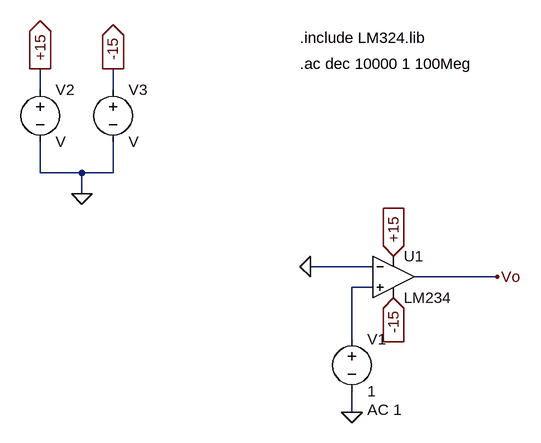
[diagram p0: schematic borrador1.asc]
borrador1.asc, the LTspice schematic file:
Version 4.1
SHEET 1 880 680
WIRE -448 -144 -448 -176
WIRE -336 -144 -336 -176
WIRE -448 -16 -448 -64
WIRE -384 -16 -448 -16
WIRE -336 -16 -336 -64
WIRE -336 -16 -384 -16
WIRE -384 16 -384 -16
WIRE 64 128 -32 128
WIRE 256 144 128 144
WIRE 64 160 32 160
WIRE 32 240 32 160
WIRE 32 352 32 320
FLAG -32 128 0
FLAG 32 352 0
FLAG -384 16 0
FLAG -448 -176 +15
IOPIN -448 -176 Out
FLAG -336 -176 -15
IOPIN -336 -176 Out
FLAG 96 112 +15
IOPIN 96 112 In
FLAG 96 176 -15
IOPIN 96 176 In
FLAG 256 144 Vo
SYMBOL OpAmps\\opamp2 96 80 R0
SYMATTR InstName U1
SYMATTR Value LM234
SYMBOL voltage 32 224 R0
WINDOW 123 24 124 Left 2
WINDOW 39 0 0 Left 0
SYMATTR InstName V1
SYMATTR Value 1
SYMATTR Value2 AC 1
SYMBOL voltage -448 -160 R0
SYMATTR InstName V2
SYMBOL voltage -336 -160 R0
SYMATTR InstName V3
TEXT -48 -224 Left 2 !.include LM324.lib
TEXT -48 -184 Left 2 !.ac dec 10000 1 100Meg

The netlist it stands for:
* borrador1.asc
X§U1 N001 0 +15 -15 Vo LM234  ; pins In+ In- V+ V- OUT
V1 N001 0 1 AC 1
V2 +15 0 V
V3 -15 0 V
.include LM324.lib
.ac dec 10000 1 100Meg
.backanno
.end